# EAGLE design SparkFun_u-blox_SAM-M10Q (EAGLE 9.6.2)
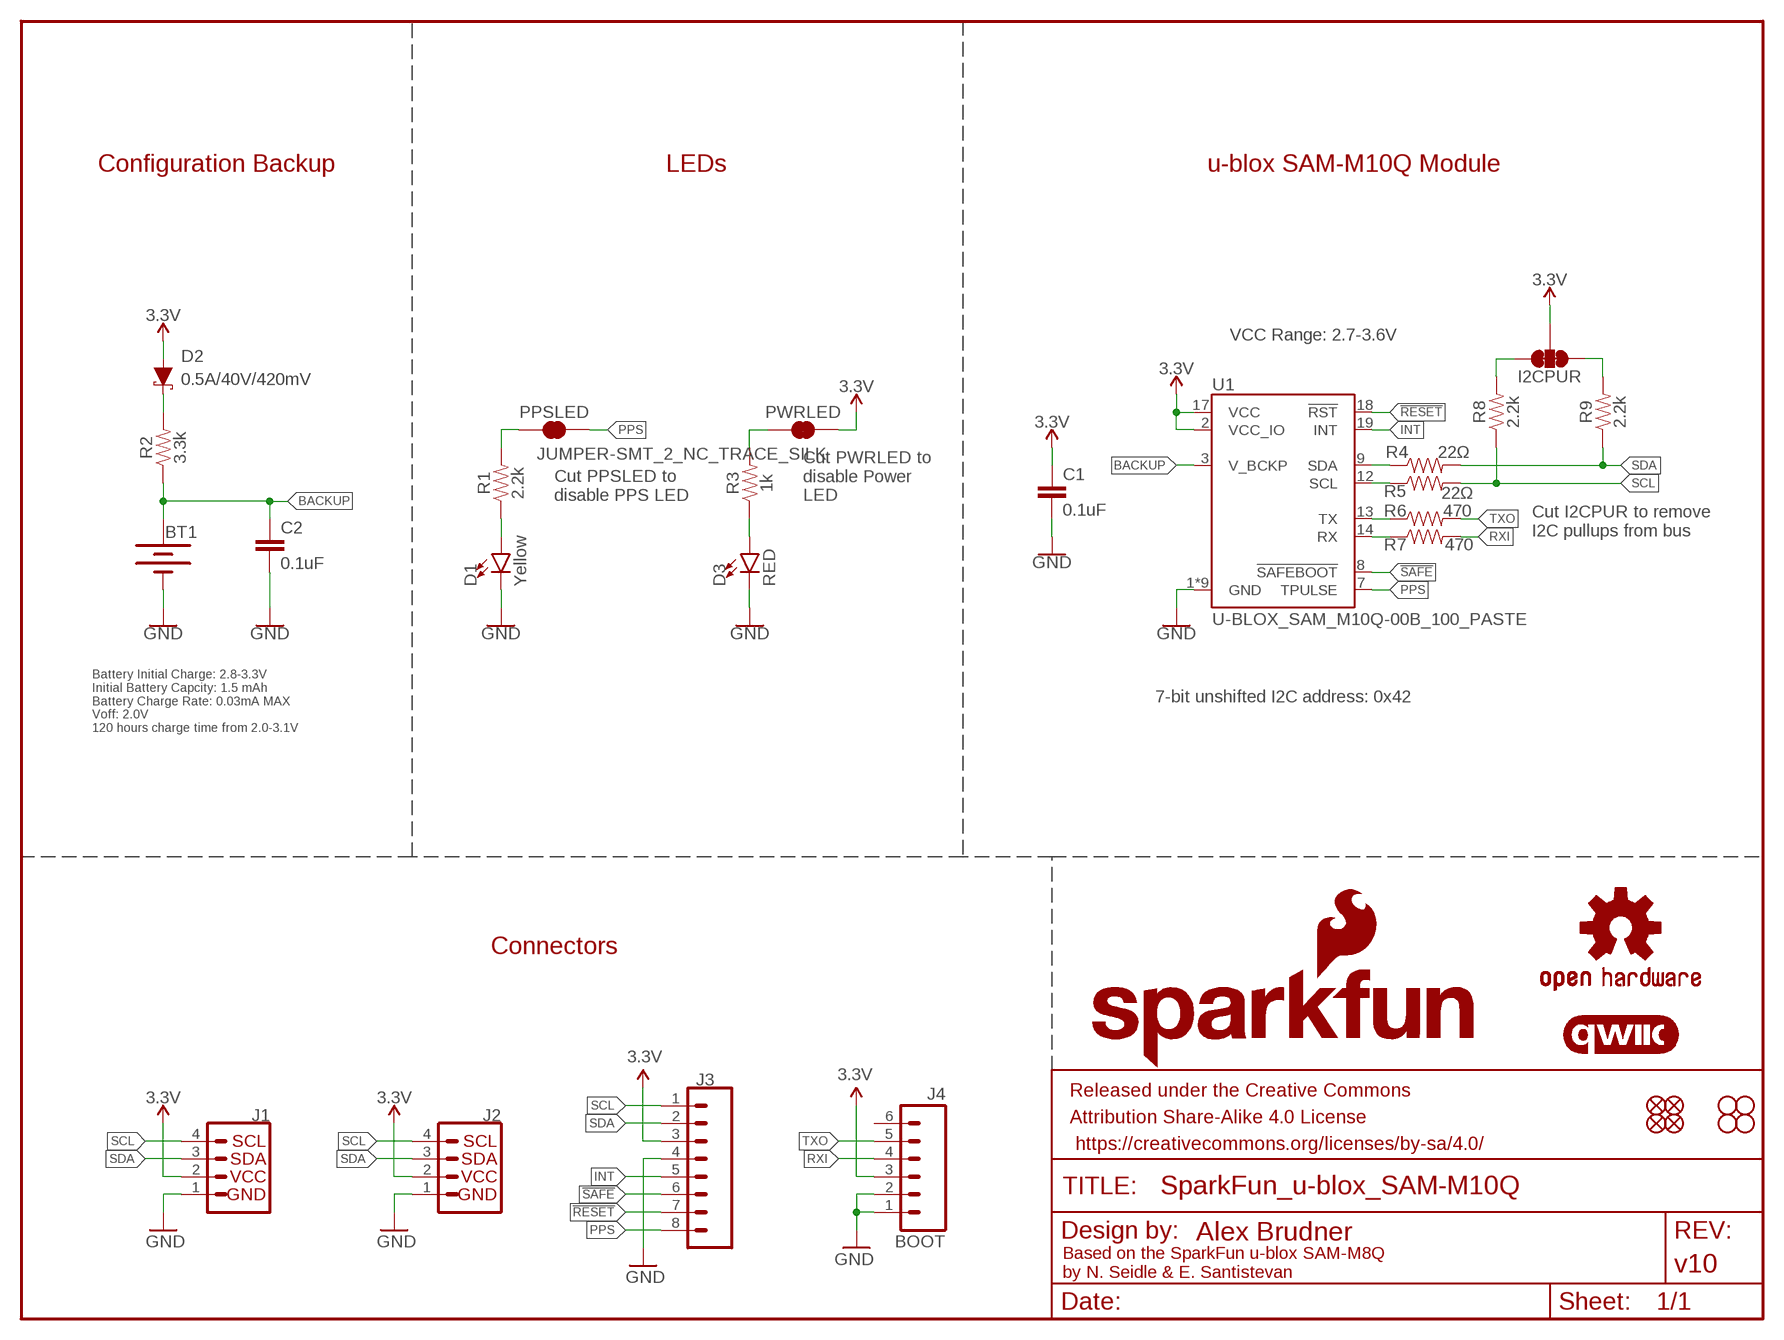
[diagram p0: schematic, sheet 1]

## Parts
BT1  6.8MM_COIN_CELL  RELOWABLE_BATTERY_MS421R  [MS421R_IV03E]
C1  0.1uF  0.1UF-0603-25V-(+80/-20%)  [0603]
C2  0.1uF  0.1UF-0603-25V-(+80/-20%)  [0603]
D1  Yellow  LED-YELLOW0603  [LED-0603]
D2  0.5A/40V/420mV  DIODE-SCHOTTKY-PMEG4005EJ  [SOD-323]
D3  RED  LED-RED0603  [LED-0603]
FD1  FIDUCIALUFIDUCIAL  [FIDUCIAL-MICRO]
FD2  FIDUCIALUFIDUCIAL  [FIDUCIAL-MICRO]
FD3  FIDUCIALUFIDUCIAL  [FIDUCIAL-MICRO]
FD4  FIDUCIALUFIDUCIAL  [FIDUCIAL-MICRO]
FRAME1  FRAME-LETTER  [CREATIVE_COMMONS]
H1  STAND-OFF  [STAND-OFF]
H2  STAND-OFF  [STAND-OFF]
H3  STAND-OFF  [STAND-OFF]
H4  STAND-OFF  [STAND-OFF]
I2CPUR  JUMPER-SMT_3_2-NC_TRACE_SILK  [SMT-JUMPER_3_2-NC_TRACE_SILK]
J1  Qwiic Right Angle  I2C_STANDARDQWIIC  [JST04_1MM_RA]
J2  Qwiic Right Angle  I2C_STANDARDQWIIC  [JST04_1MM_RA]
J3  CONN_08NO_SILK_FEMALE_PTH  [1X08_NO_SILK]
J4  BOOT  CONN_06NO_SILK_NO_POP  [1X06_NO_SILK]
LOGO1  OSHW-LOGOM  [OSHW-LOGO-M]
LOGO2  SFE_LOGO_NAME_FLAME.2_INCH  [SFE_LOGO_NAME_FLAME_.2]
LOGO3  QWIIC_LOGO_CONNECTOR  [QWIIC_5.5MM]
PPSLED  JUMPER-SMT_2_NC_TRACE_SILK  [SMT-JUMPER_2_NC_TRACE_SILK]
PWRLED  JUMPER-SMT_2_NC_TRACE_SILK  [SMT-JUMPER_2_NC_TRACE_SILK]
R1  2.2k  2.2KOHM-0603-1/10W-1%  [0603]
R2  3.3k  3.3KOHM-0603-1/10W-1%  [0603]
R3  1k  1KOHM-0603-1/10W-1%  [0603]
R4  22Ω  22OHM-0603-1/10W-1%  [0603]
R5  22Ω  22OHM-0603-1/10W-1%  [0603]
R6  470  470OHM-0603-1/10W-1%  [0603]
R7  470  470OHM-0603-1/10W-1%  [0603]
R8  2.2k  2.2KOHM-0603-1/10W-1%  [0603]
R9  2.2k  2.2KOHM-0603-1/10W-1%  [0603]
U1  U-BLOX_SAM_M10Q-00B_100_PASTE  [SAM-M10Q_100PASTE]

## Nets
3.3V: C1.1 D2.A I2CPUR.2 J1.2 J2.2 J3.3 J4.3 PWRLED.2 U1.2(VCC_IO) U1.17(VCC)
!RESET: J3.7 U1.18(!RST)
!SAFE: J3.6 U1.8(!SAFEBOOT)
BACKUP: BT1.+ C2.1 R2.1 U1.3(V_BCKP)
GND: BT1.- C1.2 C2.2 D1.C D3.C J1.1 J2.1 J3.4 J4.1 J4.2 U1.1(GND) U1.4(GND) U1.5(GND) U1.6(GND) U1.10(GND) U1.11(GND) U1.15(GND) U1.16(GND) U1.20(GND)
INT: J3.5 U1.19(INT)
N$1: PWRLED.1 R3.2
N$2: D1.A R1.1
N$3: D3.A R3.1
N$4: PPSLED.1 R1.2
N$5: I2CPUR.1 R9.2
N$6: D2.C R2.2
N$8: I2CPUR.3 R8.2
PPS: J3.8 PPSLED.2 U1.7(TPULSE)
RXI: J4.4 R7.2
RXLV: R7.1 U1.14(RX)
SCL: J1.4 J2.4 J3.1 R5.2 R8.1
SCL_LV: R5.1 U1.12(SCL)
SDA: J1.3 J2.3 J3.2 R4.2 R9.1
SDA_LV: R4.1 U1.9(SDA)
TXLV: R6.1 U1.13(TX)
TXO: J4.5 R6.2
Unconnected: J4.6

## Notes on the sheet
- Configuration Backup | LEDs | u-blox SAM-M10Q Module
- VCC Range: 2.7-3.6V
- Cut PPSLED to 
  disable PPS LED
- Cut PWRLED to 
  disable Power 
  LED
- Cut I2CPUR to remove 
  I2C pullups from bus
- 7-bit unshifted I2C address: 0x42
- Battery Initial Charge: 2.8-3.3V
  Initial Battery Capcity: 1.5 mAh
  Battery Charge Rate: 0.03mA MAX
  Voff: 2.0V
  120 hours charge time from 2.0-3.1V
- Connectors
- Based on the SparkFun u-blox SAM-M8Q 
  by N. Seidle & E. Santistevan

## Library data of the parts
BT1 = SparkFun-Batteries:RELOWABLE_BATTERY: SEIKO Reflowable Lithium Batteries; PROD_ID: BAT-16685
C1 C2 = SparkFun-Capacitors:0.1UF: 0.1µF ceramic capacitors A capacitor is a passive two-terminal electrical component used to store electrical energy temporarily in an electric field.; PROD_ID: CAP-00810
D1 = SparkFun-LED:LED-YELLOW: Yellow SMD LED Used in manufacturing several products at SparkFun. Packages: 0603 - SMD 0603 package[Product Link] <http://www.kingbrightusa.com/product.asp?catalog_name=LED&product_id=APT1608SYCK> 0603 -SMART - SMART SMD 0603 package (more efficient/more expensive) [Product Link] <http://www.osram-os.com/osram_os/en/products/product-catalog/led-light-emitting-diodes/smartled-0603/ly-l29k/index.jsp> LilyPad - SMD1206 package[Product Datasheet] <https://www.sparkfun.com/datasheets/DevTools/LilyPad/Q150YUS4.pdf> SparkFun Products: Blynk Board <https://www.sparkfun.com/products/13794> IOIO-OTG <https://www.sparkfun.com/products/13613> XBee Explorer Serial <https://www.sparkfun.com/products/13225>; PROD_ID: DIO-09003
D2 = SparkFun-DiscreteSemi:DIODE-SCHOTTKY: Schottky diode A Schottky diode is a semiconductor diode which has a low forward voltage drop and a very fast switching action.; PROD_ID: DIO-10955
D3 = SparkFun-LED:LED-RED: Red SMD LED Used in manufacturing of most products at SparkFun Packages: 0603 - KB - KingBright (DIO-17976) SMD 0603 package [Datasheet] <https://www.kingbrightusa.com/images/catalog/SPEC/APT1608SURCK.pdf> 0603 - (DIO-00819, has gone EOL) SMD 0603 package 0603 SMART - SMD 0603 SMART package ( more efficient and expensive)[Product Link] <http://www.osram-os.com/Graphics/XPic2/00077099_0.pdf> 1206 - SMD1206 package [Product Link] <https://www.sparkfun.com/datasheets/DevTools/LilyPad/Q150OVS4.pdff> SparkFun Products: Pro Mini 328 -5V <https://www.sparkfun.com/products/821> RedBoard <https://www.sparkfun.com/products/12757> IOIO-OTG <https://www.sparkfun.com/products/13613>; PROD_ID: DIO-00819
FD1-FD4 = SparkFun-Aesthetics:FIDUCIAL: Fiducial Alignment Points Point-of-reference for pick-and-place machines and other optical instruments.
FRAME1 = SparkFun-Aesthetics:FRAME-LETTER: Schematic Frame - Letter Standard 8.5x11 US Letter frame; DESIGNER: Alex Brudner; REV: v10
H1-H4 = SparkFun-Hardware:STAND-OFF: Stand Off Drill holes for mechanically mounting via screws, standoffs, etc. Note: Use the keepout ring to avoid running the screw head into surrounding components. Variant Overviews STAND-OFF - Mechanical footprint for a #4 phillips button head screw. STAND-OFF-TIGHT - Mechanical footprint for a #4 phillips button head screw, Example SparkFun Products Screw - Phillips Head (1/4", 4-40, 10 pack) <https://www.sparkfun.com/products/10453> (PRT-10453) Screw - Phillips Head (1/2", 4-40, 10 pack) <https://www.sparkfun.com/products/10452> (PRT-10452) Screw - Phillips Head (3/4", 4-40, 10 pack) <https://www.sparkfun.com/products/10451> (PRT-10451) Screw - Phillips Head (1", 4-40, 10 pack) <https://www.sparkfun.com/products/10450> (PRT-10450)
I2CPUR = SparkFun-Jumpers:JUMPER-SMT_3_2-NC_TRACE: Normally closed trace jumper (2 of 2 connections) This jumper has a trace between all three pads so they are normally closed (NC). Use a razor knife to open the connection(s). For best results follow the IPC guidelines for cutting traces: Cutout at least 0.063 mm (0.005 in). Remove all loose material to clean up the cut area. Seal the cut with an approved epoxy. Reapply solder to reclose the connection(s).
J1 J2 = SparkFun-Connectors:I2C_STANDARD: SparkFun I2C Standard Pinout Header SparkFun has standardized on a pinout for all I2C based sensor breakouts. This pinout allows I2C boards to be plugged directly into the headers on Arduino Uno compatible boards, and to be daisy chained easily. Example SparkFun Products: SparkFun Atmospheric Sensor Breakout - BME280 <https://www.sparkfun.com/products/13676> SparkFun Altitude/Pressure Sensor Breakout - MPL3115A2 <https://www.sparkfun.com/products/11084> SparkFun TOF Range Finder Sensor - VL6180 <https://www.sparkfun.com/products/12785>; PROD_ID: CONN-13694
J3 = SparkFun-Connectors:CONN_08: Multi connection point. Often used as Generic Header-pin footprint for 0.1 inch spaced/style header connections On any of the 0.1 inch spaced packages, you can populate with these: Break Away Headers - Straight <https://www.sparkfun.com/products/116> (PRT-00116) Break Away Male Headers - Right Angle <https://www.sparkfun.com/products/553> (PRT-00553) Female Headers <https://www.sparkfun.com/products/115> (PRT-00115) Break Away Headers - Machine Pin <https://www.sparkfun.com/products/117> (PRT-00117) Break Away Female Headers - Swiss Machine Pin <https://www.sparkfun.com/products/743> (PRT-00743) Arduino Stackable Header - 8 Pin <https://www.sparkfun.com/products/9279> (PRT-09279) For SCREWTERMINALS and SPRING TERMINALS visit here: Screw Terimnals on SparkFun.com <https://www.sparkfun.com/search/results?term=Screw+Terminals> (5mm/3.5mm/2.54mm spacing) This device is also useful as a general connection point to wire up your design to another part of your project. Our various solder wires solder well into these plated through hole pads. Hook-Up Wire - Assortment (Stranded, 22 AWG) <https://www.sparkfun.com/products/11375> (PRT-11375) Hook-Up Wire - Assortment (Solid Core, 22 AWG) <https://www.sparkfun.com/products/11367> (PRT-11367) View the entire wire category on our website here <https://www.sparkfun.com/categories/141> Special notes: Molex polarized connector foot print use with SKU : PRT-08231 with associated crimp pins and housings. 1MM SMD Version SKU: PRT-10208 NOTES ON THE VARIANTS LOCK and LOCK_LONGPADS... This footprint was designed to help hold the alignment of a through-hole component (i.e. 6-pin header) while soldering it into place. You may notice that each hole has been shifted either up or down by 0.005 of an inch from it's more standard position (which is a perfectly straight line). This slight alteration caused the pins (the squares in the middle) to touch the edges of the holes. Because they are alternating, it causes a "brace" to hold the component in place. 0.005 has proven to be the perfect amount of "off-center" position when using our standard breakaway headers. Although looks a little odd when you look at the bare footprint, once you have a header in there, the alteration is very hard to notice. Also,if you push a header all the way into place, it is covered up entirely on the bottom side.; PROD_ID: CONN-08438
J4 = SparkFun-Connectors:CONN_06: Multi connection point. Often used as Generic Header-pin footprint for 0.1 inch spaced/style header connections On any of the 0.1 inch spaced packages, you can populate with these: Break Away Headers - Straight <https://www.sparkfun.com/products/116> (PRT-00116) Break Away Male Headers - Right Angle <https://www.sparkfun.com/products/553> (PRT-00553) Female Headers <https://www.sparkfun.com/products/115> (PRT-00115) Break Away Headers - Machine Pin <https://www.sparkfun.com/products/117> (PRT-00117) Break Away Female Headers - Swiss Machine Pin <https://www.sparkfun.com/products/743> (PRT-00743) Arduino Stackable Header - 6 Pin <https://www.sparkfun.com/products/9280> (PRT-09280) Screw Terminals 2.54mm Pitch (6-Pin) <https://www.sparkfun.com/products/16499> (PRT-16499) For SCREWTERMINALS and SPRING TERMINALS visit here: Screw Terimnals on SparkFun.com <https://www.sparkfun.com/search/results?term=Screw+Terminals> (5mm/3.5mm/2.54mm spacing) This device is also useful as a general connection point to wire up your design to another part of your project. Our various solder wires solder well into these plated through hole pads. Hook-Up Wire - Assortment (Stranded, 22 AWG) <https://www.sparkfun.com/products/11375> (PRT-11375) Hook-Up Wire - Assortment (Solid Core, 22 AWG) <https://www.sparkfun.com/products/11367> (PRT-11367) View the entire wire category on our website here <https://www.sparkfun.com/categories/141>
LOGO1 = SparkFun-Aesthetics:OSHW-LOGO: Open-Source Hardware (OSHW) Logo This logo indicates the piece of hardware it is found on incorporates a OSHW license and/or adheres to the definition of open source hardware found here: http://freedomdefined.org/OSHW
LOGO2 = SparkFun-Aesthetics:SFE_LOGO_NAME_FLAME: SparkFun Font Logo w/ Flame This is the SparkFun full logo. The logo on the schematic will always be the same size; the package variant is the height of the flame part of the logo. Default layer for the logo on the board is tSilk.
LOGO3 = SparkFun-Aesthetics:QWIIC_LOGO: Qwiic Logos for placement on schematic and PCB. The 5.5mm silk logo is best for placing next to Qwiic connector.
PPSLED PWRLED = SparkFun-Jumpers:JUMPER-SMT_2_NC_TRACE: Normally closed trace jumper This jumper has a trace between two pads so it's normally closed (NC). Use a razor knife to open the connection. For best results follow the IPC guidelines for cutting traces: Cutout at least 0.063 mm (0.005 in). Remove all loose material to clean up the cut area. Seal the cut with an approved epoxy. Reapply solder to reclose the connection.
R1 R8 R9 = SparkFun-Resistors:2.2KOHM: 2.2kΩ resistor A resistor is a passive two-terminal electrical component that implements electrical resistance as a circuit element. Resistors act to reduce current flow, and, at the same time, act to lower voltage levels within circuits. - Wikipedia; PROD_ID: RES-08272
R2 = SparkFun-Resistors:3.3KOHM: 3.3kΩ resistor A resistor is a passive two-terminal electrical component that implements electrical resistance as a circuit element. Resistors act to reduce current flow, and, at the same time, act to lower voltage levels within circuits. - Wikipedia; PROD_ID: RES-07851
R3 = SparkFun-Resistors:1KOHM: 1kΩ resistor A resistor is a passive two-terminal electrical component that implements electrical resistance as a circuit element. Resistors act to reduce current flow, and, at the same time, act to lower voltage levels within circuits. - Wikipedia; PROD_ID: RES-07856
R4 R5 = SparkFun-Resistors:22OHM: 22Ω resistor A resistor is a passive two-terminal electrical component that implements electrical resistance as a circuit element. Resistors act to reduce current flow, and, at the same time, act to lower voltage levels within circuits. - Wikipedia; PROD_ID: RES-08698
R6 R7 = SparkFun-Resistors:470OHM: 470Ω resistor A resistor is a passive two-terminal electrical component that implements electrical resistance as a circuit element. Resistors act to reduce current flow, and, at the same time, act to lower voltage levels within circuits. - Wikipedia; PROD_ID: RES-07869
U1 = u-blox_SAM-M10Q:U-BLOX_SAM_M10Q-00B: u-blox SAM-M10Q The u-blox SAM-M10Q concurrent GNSS patch antenna module benefits from the exceptional performance of the u-blox M10 multi-GNSS engine. The SAM-M10Q module offers high sensitivity and minimal acquisition times in an extremely low power and ultra compact form factor. The SAM-M10Q module utilizes concurrent reception of four GNSS systems (GPS, Galileo, GLONASS, and BeiDou), recognizes multiple constellations simultaneously and provides outstanding positioning accuracy in scenarios where urban canyon or weak signals are involved. For even better and faster positioning improvement, the SAM-M10Q features the u-blox Super-S (Super-Signal) technology, offering great RF sensitivity that can improve the dynamic position accuracy in non-line-of-sight scenarios. The SAM-M10Q also features a front-end SAW filter and an integrated LNA, ensuring excellent out-of-band jamming immunity. It also can detect jamming and spoofing attempts and report them to the host, so that the system can react to such events. The SAM-M10Q uses the latest UBX API, which is supported by SparkFun's u-blox GNSS Arduino Library - v3 <https://github.com/sparkfun/SparkFun_u-blox_GNSS_v3>.; PROD_ID: IC-17910

## Board
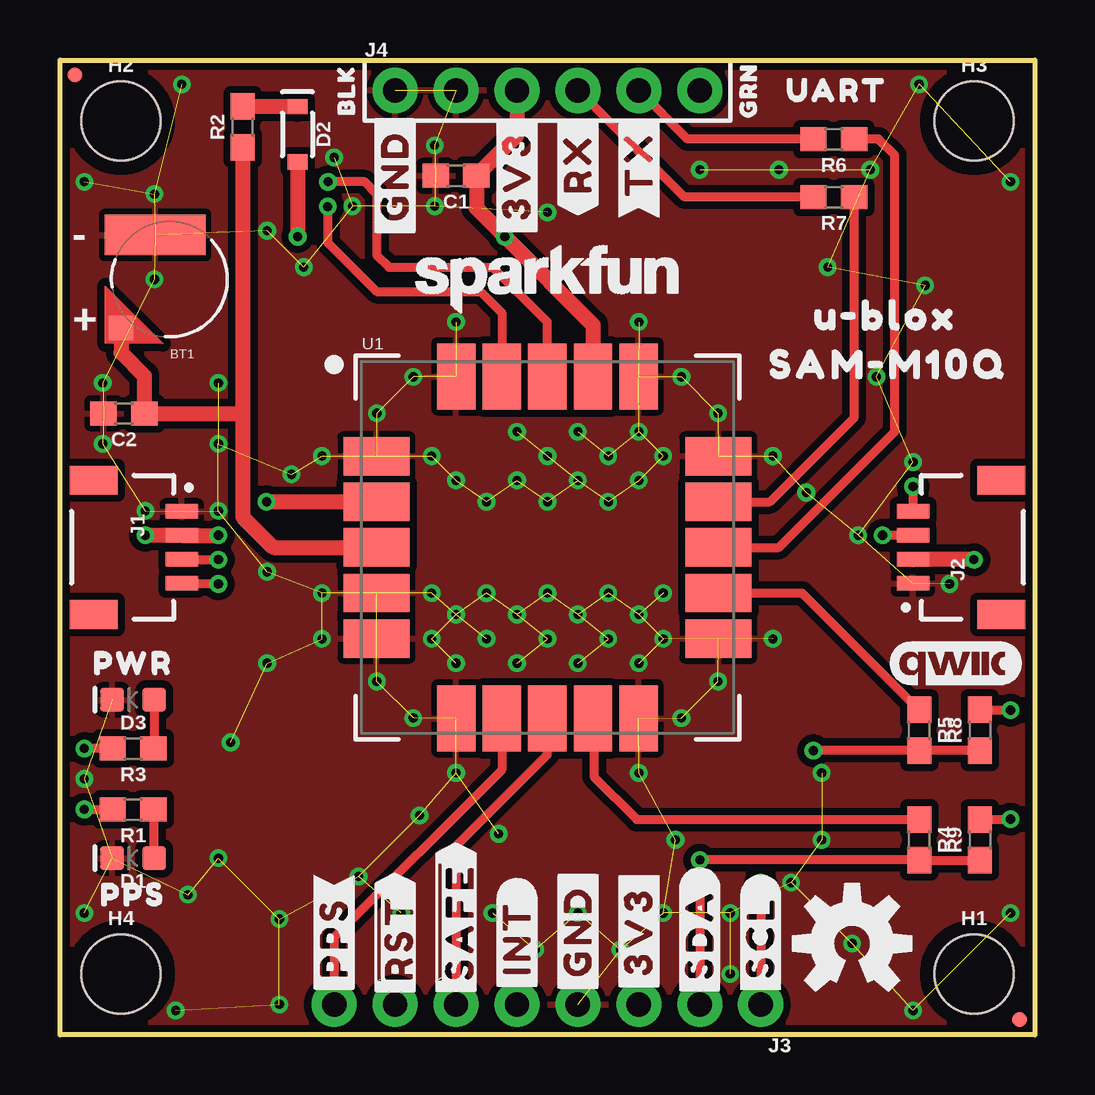
[diagram p1: board, top side]
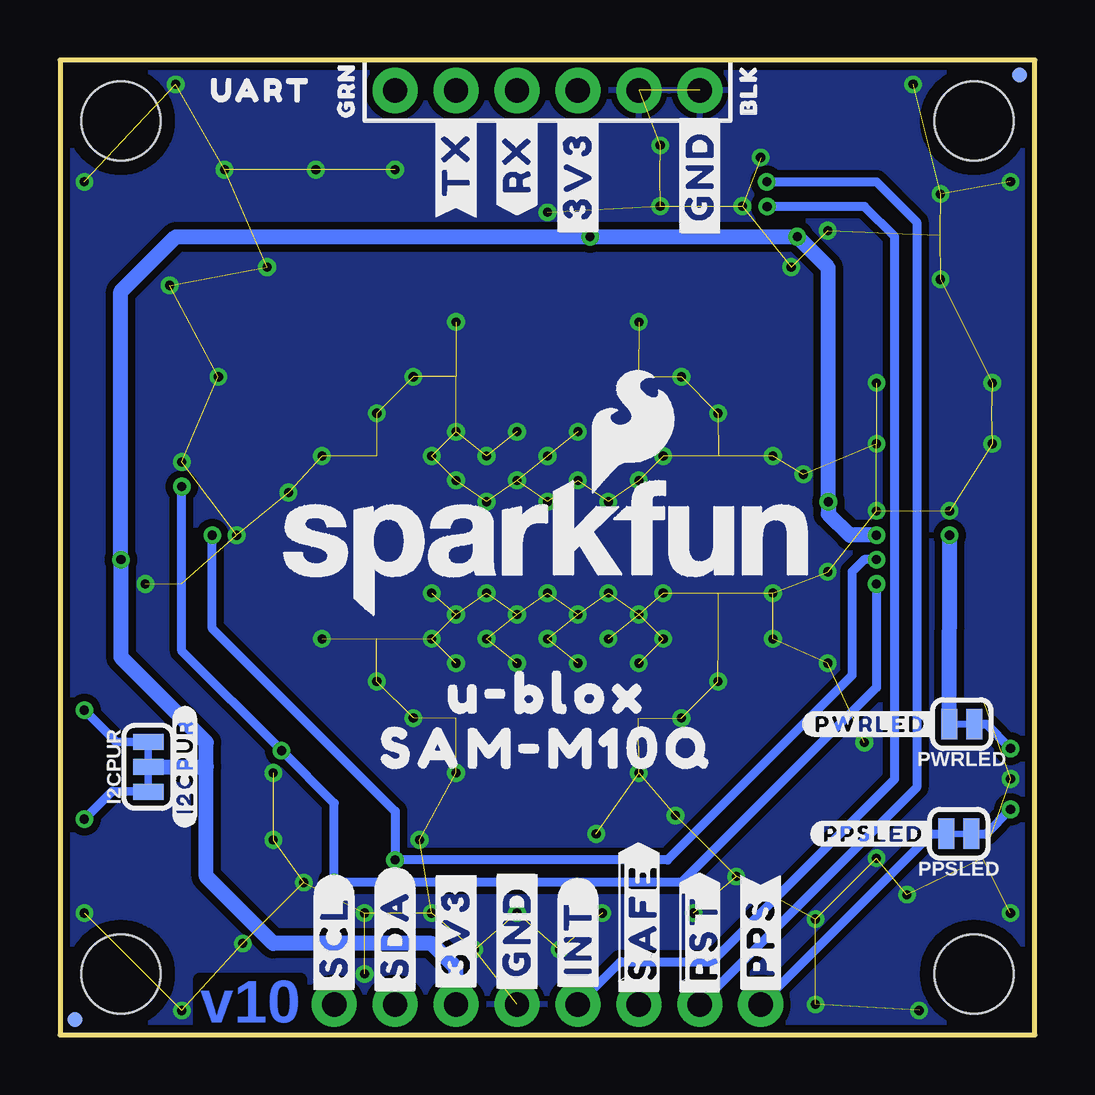
[diagram p2: board, bottom side, seen from below]

Size 40.64 x 40.64 mm. Coordinates in mm from the lower left corner, seen from the top.
Outline: 0,0 0,40.64 40.64,40.64 40.64,0 0,0
Copper layers (1*16): Top 0.035mm / dielectric 1.5mm / Bottom 0.035mm
Design rules "SparkFun-2-Layer-General-JLCPCB": minimum track width 7mil, minimum drill 0.3mm, track to track 7mil, track to pad 7mil, pad to pad 7mil, via to via 7mil, smd to smd 7mil, copper to edge 7mil, drill to drill 7mil, minimum pad ring 7mil, minimum via ring 7mil, stop-mask expansion 3mil, vias tented up to drill 25mil, thermal gap 10mil
tRestrict: area 13,17.4 to 13.5,17.5

### Footprints (pad centres in the part's own frame; a part is rotated, then mirrored left to right if it is on the bottom)
MS421R_IV03E = smd 1 x 1: + 2.022,2.032 | smd 4.2 x 1.7: - 0.6,-1.85
0603 = smd 1.1 x 1: 1 -0.85,0; 2 0.85,0
LED-0603 = smd 1 x 1: A -0.877,0; C 0.877,0
SOD-323 = smd 0.63 x 0.83: A 1.15,0; C -1.15,0
FIDUCIAL-MICRO = smd 0.635 x 0.635: 1 0,0
STAND-OFF = hole 3.302: 0,0
SMT-JUMPER_3_2-NC_TRACE_SILK = smd 0.66 x 1.27: 1 -1.041,0; 2 0,0; 3 1.041,0
JST04_1MM_RA = smd 0.6 x 1.35: 1 -1.5,0; 2 -0.5,0; 3 0.5,0; 4 1.5,0 | smd 1.2 x 2: NC1 2.8,-3.675; NC2 -2.8,-3.675
1X08_NO_SILK = drill 1.016 pad 1.88: 1 0,0; 2 2.54,0; 3 5.08,0; 4 7.62,0; 5 10.16,0; 6 12.7,0; 7 15.24,0; 8 17.78,0
1X06_NO_SILK = drill 1.016 pad 1.88: 1 0,0; 2 2.54,0; 3 5.08,0; 4 7.62,0; 5 10.16,0; 6 12.7,0
SMT-JUMPER_2_NC_TRACE_SILK = smd 0.66 x 1.27: 1 -0.521,0; 2 0.521,0
SAM-M10Q_100PASTE = smd 2.75 x 1.6: 1 -7.125,3.8; 2 -7.125,1.9; 3 -7.125,0; 4 -7.125,-1.9; 5 -7.125,-3.8; 11 7.125,-3.8; 12 7.125,-1.9; 13 7.125,0; 14 7.125,1.9; 15 7.125,3.8 | smd 1.6 x 2.75: 6 -3.8,-7.125; 7 -1.9,-7.125; 8 0,-7.125; 9 1.9,-7.125; 10 3.8,-7.125; 16 3.8,7.125; 17 1.9,7.125; 18 0,7.125; 19 -1.9,7.125; 20 -3.8,7.125

### Placement (x,y rotation side)
BT1  4.57,31.5 180 top
C1  16.51,35.81 180 top
C2  2.67,25.91 180 top
D1  3.05,7.37 180 top
D2  9.91,37.54 270 top
D3  3.05,13.97 180 top
FD1  40.01,0.64 0 bottom
FD2  0.64,40.01 0 top
FD3  0.64,40.01 0 bottom
FD4  40.01,0.64 0 top
FRAME1  21.59,-8.89 0 top  (outside the outline)
H1  38.1,2.54 0 top
H2  2.54,38.1 0 top
H3  38.1,38.1 0 top
H4  2.54,2.54 0 top
I2CPUR  36.96,11.18 90 bottom
J1  5.08,20.32 270 top
J2  35.56,20.32 90 top
J3  29.21,1.27 180 top
J4  13.97,39.37 0 top
LOGO1  33.02,3.81 0 top
LOGO2  20.32,20.32 0 bottom
LOGO3  37.34,15.49 0 top
PPSLED  3.17,8.38 180 bottom
PWRLED  3.05,12.95 180 bottom
R1  3.05,9.4 180 top
R2  7.62,37.85 90 top
R3  3.05,11.94 180 top
R4  35.81,8.13 270 top
R5  35.81,12.7 270 top
R6  32.26,37.34 180 top
R7  32.26,34.92 180 top
R8  38.35,12.7 90 top
R9  38.35,8.13 90 top
U1  20.32,20.32 0 top
U$1  [SFE_LOGO_FLAME_STOP_.1]  7.11,2.54 0 top
U$2  [SAM#M10Q11]  34.54,27.94 0 top
U$3  [BLK4]  11.94,39.37 90 top
U$4  [BLK4]  11.94,39.37 90 bottom
U$5  [GRN5]  28.7,39.37 90 top
U$6  [GRN5]  28.7,39.37 90 bottom
U$7  [UART7]  32.38,39.37 0 top
U$8  [UART7]  32.26,39.37 0 bottom
U$9  [PPS9]  3.05,5.84 0 top
U$10  [PWR10]  3.05,15.49 0 top
U$11  [#TX#12]  24.13,36.32 90 top
U$12  [#TX#12]  24.13,36.32 90 bottom
U$13  [#RX#13]  21.59,36.32 90 top
U$14  [#RX#13]  21.59,36.32 90 bottom
U$15  [#3V3#0]  19.05,35.81 90 top
U$16  [#3V3#0]  19.05,35.81 90 bottom
U$17  [#GND#4]  13.97,35.81 90 top
U$18  [U#BLOX11]  34.42,29.97 0 top
U$19  [#GND#5]  21.59,4.32 90 top
U$20  [#GND#4]  13.97,35.81 90 bottom
U$21  [#GND#5]  21.59,4.32 90 bottom
U$22  [#3V3#0]  24.13,4.32 90 top
U$23  [#3V3#0]  24.13,4.32 90 bottom
U$24  [#SCL#6]  29.21,4.06 90 top
U$25  [#SCL#6]  29.21,4.06 90 bottom
U$26  [#SDA#7]  26.67,4.19 90 top
U$27  [#SDA#7]  26.67,4.19 90 bottom
U$28  [#INT#8]  19.05,4.06 90 top
U$29  [#INT#8]  19.05,4.06 90 bottom
U$30  [##RST##15]  13.97,4.06 90 top
U$31  [SFE_LOGO_NAME_.1]  20.32,31.5 0 top
U$32  [SAM#M10Q12]  20.32,11.94 0 bottom
U$33  [##RST##15]  13.97,4.06 90 bottom
U$34  [#PPS#13]  11.43,4.06 90 top
U$35  [#PPS#13]  11.43,4.06 90 bottom
U$36  [##SAFE##16]  16.51,4.7 90 top
U$37  [##SAFE##16]  16.51,4.7 90 bottom
U$38  [U#BLOX12]  20.32,14.22 0 bottom
U$40  [#PPSLED#0]  6.73,8.38 0 bottom
U$41  [#I2CPUR#0]  35.43,11.18 90 bottom
U$42  [#PWRLED#0]  6.86,12.95 0 bottom

### Tracks (layer width: path | path; a pad name or v marks a point on that pad's centre or on a via)
3.3V  (via drill 0.38)
  Top 0.635: v38.1,19.81 J2.2 | v3.56,20.83 J1.2 v6.6,20.82 v6.6,20.83 | J4.3 19.05,37.5 C1.1 17.36,34.46 v18.54,33.27 22.22,29.6 U1.17 | U1.2 v8.62,22.22 v8.61,22.23 | D2.A v9.91,33.27
  Bottom 0.635: PWRLED.2 v3.56,20.83 | v6.6,20.83 7.72,20.83 8.61,21.72 v8.61,22.23 8.61,31.98 v9.91,33.27 v18.54,33.27 35.81,33.27 38.1,30.99 v38.1,19.81 38.1,15.75 34.54,12.19 34.54,11.18 | J3.3 24.13,2.79 25.15,3.81 31.75,3.81 34.54,6.6 34.54,11.18 | I2CPUR.2 34.54,11.18
!RESET  (via drill 0.38)
  Top 0.381: U1.18 20.32,29.72 18.03,32 13.72,32 13.21,32.51 13.21,35.05 12.7,35.56 v11.18,35.56
  Bottom 0.381: J3.7 4.93,10.31 4.93,33.88 6.6,35.56 v11.18,35.56
!SAFE
  Top 0.381: J3.6 16.51,7.87 20.32,11.68 U1.8
BACKUP
  Top 0.635: R2.1 7.62,25.91 | 7.62,25.91 7.62,21.59 8.89,20.32 U1.3 | BT1.+ 2.55,28.44 3.52,27.47 C2.1 7.62,25.91
GND  (via drill 0.38)  (125 unrouted)
  other vias: 3.94,35.05 3.94,31.5 16.51,29.72 14.73,27.43 15.49,24.13 13.21,25.91 10.92,24.13 24.13,29.72 25.91,27.43 24.13,25.15 25.15,24.13 27.43,25.91 29.72,24.13 10.92,18.41 15.49,18.41 15.49,16.51 16.51,15.49 14.73,13.21 16.51,10.92 13.21,14.73 10.92,16.51 24.13,10.92 25.91,13.21 24.13,15.49 25.15,16.51 27.43,14.73 29.72,16.51 37.08,18.8 3.56,21.84 33.02,3.81 1.02,10.67 1.02,5.08 4.83,1.02 9.14,1.27 5.33,5.84 6.6,7.37 9.14,4.83 12.45,6.6 7.11,12.19 18.03,5.08 19.81,3.56 21.59,5.08 23.37,3.56 25.15,5.08 25.65,8.13 18.29,8.38 14.99,9.14 8.64,15.49 8.64,19.3 9.65,23.37 1.78,24.64 1.78,27.18 6.6,24.64 6.6,21.84 6.6,27.18 1.02,35.56 5.08,39.62 11.43,36.58 12.19,34.54 8.64,33.53 10.16,32 15.62,37.08 15.62,34.54 20.32,34.29 26.67,36.07 29.97,36.07 33.78,36.07 35.81,39.62 39.62,35.56 32,32 36.07,31.24 34.04,27.43 31.11,22.61 35.56,23.88 33.27,20.83 31.75,10.92 30.48,6.35 35.56,1.02 39.62,5.08 14.22,5.08 27.94,5.08 27.94,2.54 16.51,17.53 17.78,18.41 17.78,16.51 19.05,17.53 19.05,15.49 20.32,16.51 21.59,15.49 20.32,18.41 21.59,17.53 22.86,16.51 22.86,18.41 24.13,17.53 25.15,18.41 24.13,23.11 22.86,22.23 21.59,23.11 22.86,24.13 21.59,25.15 20.32,24.13 19.05,25.15 19.05,23.11 20.32,22.23 17.78,22.23 16.51,23.11 31.75,8.13
  pour Top (isolate 0.305): 0,40.64 0,0 40.64,0 40.64,40.64
  pour Bottom (isolate 0.305): 0,40.64 0,0 40.64,0 40.64,40.64
INT  (via drill 0.38)
  Top 0.381: v11.16,34.53 11.16,33.03 13.21,30.99 17.53,30.99 18.42,30.09 U1.19
  Bottom 0.381: J3.5 17.27,3.05 13.46,3.05 5.84,10.67 5.84,33.27 7.1,34.53 v11.16,34.53
N$1  (via drill 0.38)
  Top 0.381: R3.2 v1.02,11.94
  Bottom 0.381: v1.02,11.94 2.03,12.95 PWRLED.1
N$2
  Top 0.381: R1.1 3.9,7.39 D1.A
N$3
  Top 0.381: D3.A 3.92,11.96 R3.1
N$4  (via drill 0.38)
  Top 0.381: v1.02,9.4 R1.2
  Bottom 0.381: PPSLED.1 2.03,8.38 v1.02,9.4
N$5  (via drill 0.38)
  Top 0.381: R9.2 39.61,8.98 v39.62,8.99
  Bottom 0.381: v39.62,8.99 38.46,10.16 I2CPUR.1
N$6
  Top 0.635: D2.C R2.2
N$8  (via drill 0.38)
  Top 0.381: R8.2 v39.61,13.55 v39.62,13.54
  Bottom 0.381: v39.62,13.54 38.28,12.19 I2CPUR.3
PPS
  Top 0.381: U1.7 18.42,11.05 11.43,4.06 J3.8
  Bottom 0.381: J3.8 4.32,8.38 PPSLED.2
RXI
  Top 0.381: R7.2 26.04,34.92 J4.4
RXLV
  Top 0.381: U1.14 29.59,22.22 33.11,25.74 R7.1
SCL  (via drill 0.38)
  Top 0.381: J1.4 6.58,18.82 v6.6,18.8 | v35.56,22.86 J2.4 | v29.21,6.35 J3.1 | R8.1 R5.2 v31.41,11.85
  Bottom 0.381: v6.6,18.8 6.6,14.48 14.73,6.35 v29.21,6.35 29.21,9.65 v31.41,11.85 35.56,16 v35.56,22.86
SCL_LV
  Top 0.381: U1.12 30.93,18.42 R5.1
SDA  (via drill 0.38)
  Top 0.381: J1.3 v6.6,19.82 v6.6,19.81 | v34.29,20.83 J2.3 | J3.2 v26.67,7.29 R4.2 R9.1
  Bottom 0.381: v6.6,19.81 7.11,19.81 7.62,19.3 7.62,14.99 15.32,7.29 v26.67,7.29 26.67,9.32 34.29,16.94 v34.29,20.83
SDA_LV
  Top 0.381: U1.9 22.26,13.15 22.26,10.76 24.04,8.98 R4.1
TXLV
  Top 0.381: U1.13 29.97,20.32 34.8,25.15 34.8,36.66 34.12,37.34 R6.1
TXO
  Top 0.381: R6.2 26.16,37.34 J4.5

### Text on the board
Bottom: v10
tPlace: - | +
Measures: All units in inches
tDocu: Alex Brudner | Based on the SAM_M8Q by N. Seidle & E. Santistevan